# Altium schematic sheet MCU.SchDoc
size 292 x 193 mm; SheetNumber: 3; SheetTotal: 4
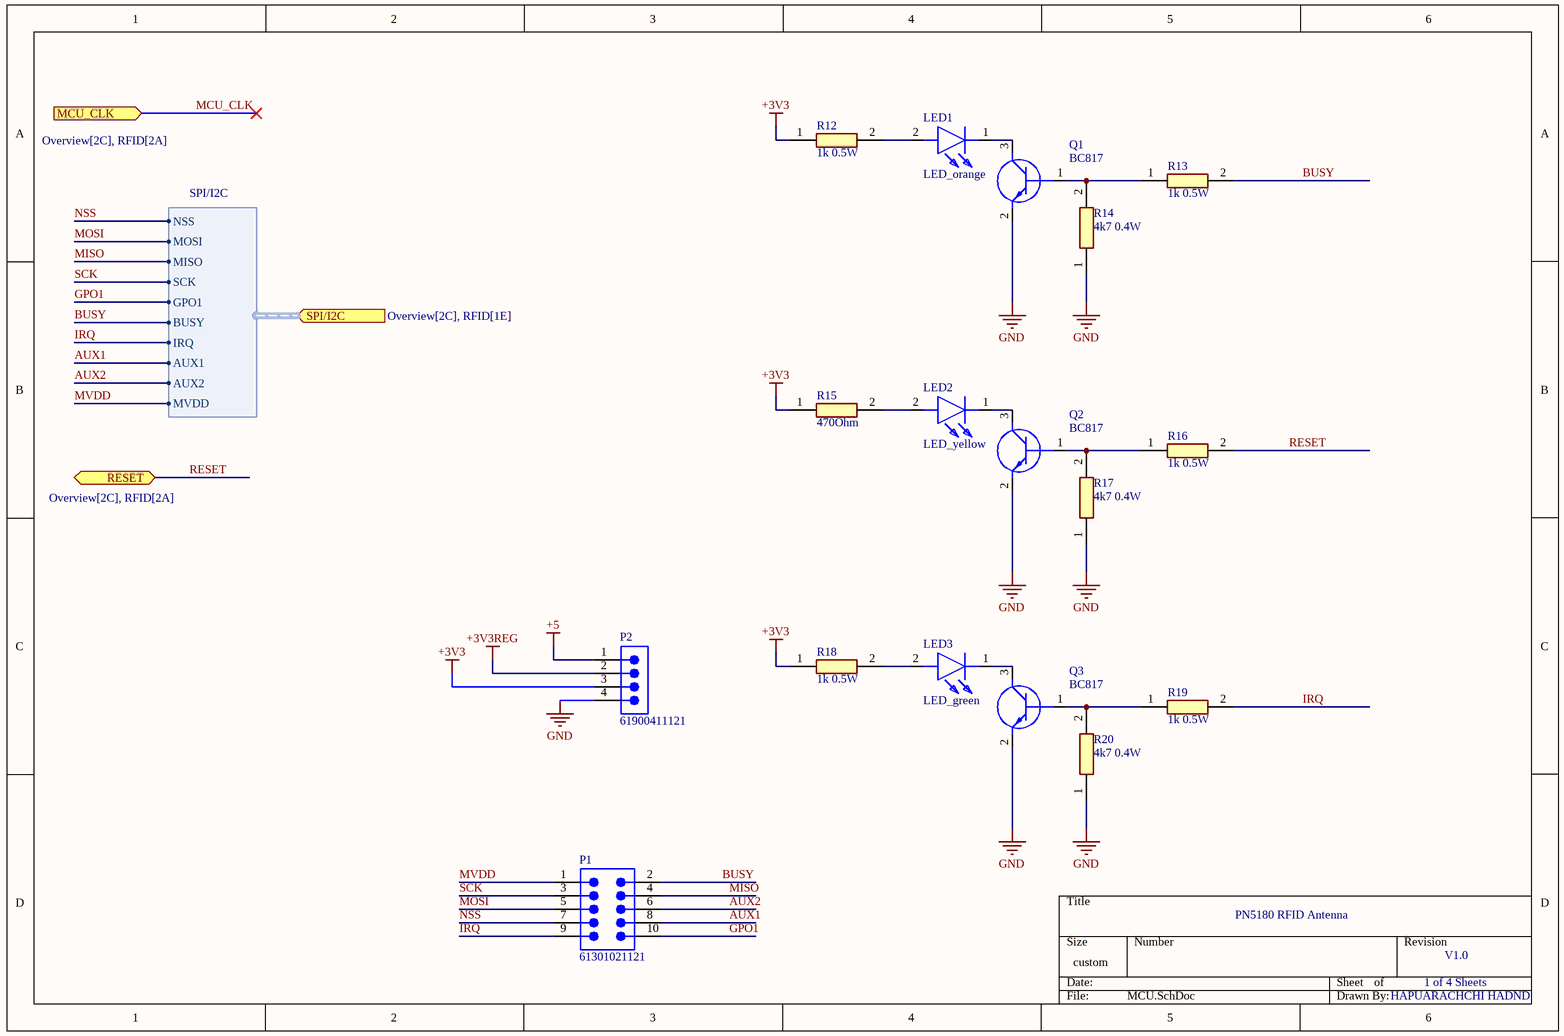
[diagram p0: MCU.SchDoc]

## Parts
LED1  LED_orange  [LEDC3216X120N]
LED2  LED_yellow  [LTSTC171KSKT]
LED3  LED_green  [LEDC2012X90N]
P1  61301021121  [61301021121]
P2  61900411121  [61900411121]
Q1  BC817  [SOT96P237X111-3N]
Q2  BC817  [SOT96P237X111-3N]
Q3  BC817  [SOT96P237X111-3N]
R12  1k 0.5W  [RESC1608X58N]
R13  1k 0.5W  [RESC1608X58N]
R14  4k7 0.4W  [RESC1608X55N_1]
R15  470Ohm  [RESC1608X55N]
R16  1k 0.5W  [RESC1608X58N]
R17  4k7 0.4W  [RESC1608X55N_1]
R18  1k 0.5W  [RESC1608X58N]
R19  1k 0.5W  [RESC1608X58N]
R20  4k7 0.4W  [RESC1608X55N_1]

## Ports
MCU_CLK (in, see Overview[2C], RFID[2A]), RESET (bidir, see Overview[2C], RFID[2A]), SPI/I2C (in, harness SPI/I2C, see Overview[2C], RFID[1E])

## Harnesses
SPI/I2C: NSS, MOSI, MISO, SCK, GPO1, BUSY, IRQ, AUX1, AUX2, MVDD

## Nets
+3V3: P2.3 R12.1 R15.1 R18.1
+3V3REG: P2.2
+5: P2.1
GND: P2.4 Q1.2(E) Q2.2(E) Q3.2(E) R14.1 R17.1 R20.1
AUX1: P1.8 ; port SPI/I2C.AUX1
AUX2: P1.6 ; port SPI/I2C.AUX2
BUSY: P1.2 R13.2 ; port SPI/I2C.BUSY
GPO1: P1.10 ; port SPI/I2C.GPO1
IRQ: P1.9 R19.2 ; port SPI/I2C.IRQ
MCU_CLK: port MCU_CLK
MISO: P1.4 ; port SPI/I2C.MISO
MOSI: P1.5 ; port SPI/I2C.MOSI
MVDD: P1.1 ; port SPI/I2C.MVDD
NSS: P1.7 ; port SPI/I2C.NSS
RESET: R16.2 ; port RESET
SCK: P1.3 ; port SPI/I2C.SCK
NetLED1_1: LED1.1(K) Q1.3(C)
NetLED1_2: LED1.2(A) R12.2
NetLED2_1: LED2.1(K) Q2.3(C)
NetLED2_2: LED2.2(A) R15.2
NetLED3_1: LED3.1(K) Q3.3(C)
NetLED3_2: LED3.2(A) R18.2
NetQ1_1: Q1.1(B) R13.1 R14.2
NetQ2_1: Q2.1(B) R16.1 R17.2
NetQ3_1: Q3.1(B) R19.1 R20.2

## Notes on the sheet
- PN5180 RFID Antenna
- 1 of 4 Sheets
- V1.0
- HAPUARACHCHI HADND

## Library data of the parts
LED1 = LED_orange: LED; Manufacturer_Name: Lite-On; Manufacturer_Part_Number: LTST-C150KAKT; Datasheet Link: http://media.digikey.com/pdf/Data%20Sheets/Lite-On%20PDFs/LTST-C150KAKT.pdf; Height: 1.2mm; Mouser Part Number: 859-LTST-C150KAKT; Mouser Price/Stock: https://www.mouser.co.uk/ProductDetail/Lite-On/LTST-C150KAKT?qs=Z3CaLxJiOJI8YYCkdyNq2A%3D%3D; Arrow Part Number: LTST-C150KAKT; Arrow Price/Stock: https://www.arrow.com/en/products/ltst-c150kakt/lite-on-technology?region=nac
LED2 = LED_yellow: LED; Manufacturer_Name: Lite-On; Manufacturer_Part_Number: LTST-C171KSKT; Datasheet Link: https://optoelectronics.liteon.com/upload/download/DS22-2000-110/LTST-C171KSKT.pdf; Height: 0.9mm; Mouser Part Number: 859-LTST-C171KSKT; Mouser Price/Stock: https://www.mouser.co.uk/ProductDetail/LITEON/LTST-C171KSKT?qs=llMtm9xcdM0CwR1bByTaUQ%3D%3D; Arrow Part Number: LTST-C171KSKT; Arrow Price/Stock: https://www.arrow.com/en/products/ltst-c171kskt/lite-on-technology?utm_currency=USD&region=nac
LED3 = LED_green: LED; Manufacturer_Name: Lite-On; Manufacturer_Part_Number: LTST-C171KGKT; Datasheet Link: https://optoelectronics.liteon.com/upload/download/DS22-2000-118/LTST-C171KGKT.pdf; Height: 0.9mm; Mouser Part Number: 859-LTST-C171KGKT; Mouser Price/Stock: https://www.mouser.co.uk/ProductDetail/LITEON/LTST-C171KGKT?qs=j1zysehuyChA38z%2F%252BFfUSw%3D%3D; Arrow Part Number: LTST-C171KGKT; Arrow Price/Stock: https://www.arrow.com/en/products/ltst-c171kgkt/lite-on-technology?region=nac
P1 = CMP-1502-01084-3: NexarPartId: 18818163; Connector Type: Male Pin; Insulation Resistance: 1GΩ; Row Spacing: 2.54mm; Insulation: Insulated; Number of Positions: 10; Current Rating: 3A; Voltage Rating: 250V; Gender: Male; Contact Resistance: 20mΩ; Contact Gender: Male; Number of Rows: 2; Min Operating Temperature: -40°C; Mount: Through Hole; Packaging: Bulk; Length: 12.7mm; Pitch: 2.54mm; RoHS: Compliant; Height: 2.54mm; Lead Pitch: 2.54mm; Number of Pins: 10; Housing Material: PBT; Orientation: Vertical; Flammability Rating: UL94 V-0; Termination: Through Hole; Width: 12.7mm; Color: Black; Contact Mating Length: 5.9944mm; Max Operating Temperature: 105°C; Operating Supply Voltage: 250V; Contact Material: Copper; Number of Contacts: 10; Contact Plating: Gold; REACH SVHC: Unknown
P2 = CMP-1502-00586-2: NexarPartId: 18818226; Connector Type: Male Pin; Insulation: Insulated; Number of Positions: 4; Gender: Male; Operating Supply Voltage: 250V; Pitch: 2.54mm; Current Rating: 3A; Insulation Resistance: 1GΩ; Contact Resistance: 20mΩ; Termination: Through Hole; Contact Material: Copper; Height: 3.3mm; Width: 10.2mm; RoHS: Compliant; REACH SVHC: Unknown; Max Operating Temperature: 105°C; Contact Plating: Tin; Lead Free: Lead Free; Contact Gender: Male; Lead Pitch: 2.54mm; Flammability Rating: UL94 V-0; Packaging: Bulk; Housing Material: Nylon; Number of Pins: 4; Number of Contacts: 4; Color: Beige; Number of Rows: 1; Orientation: Vertical; Contact Mating Length: 7.493mm; Mount: Through Hole; Min Operating Temperature: -40°C; Voltage Rating: 250V; Fastening Type: Friction; Length: 10.16mm
Q1-Q3 = BC817: Bipolar (BJT) Transistor NPN 80 V 500 mA 100MHz 225 mW Surface Mount SOT-23-3 (TO-236); Manufacturer_Name: onsemi; Manufacturer_Part_Number: SMMBTA06LT3G; Datasheet Link: https://www.onsemi.com/pub/Collateral/MMBTA05LT1-D.PDF; Height: 1.11mm; Mouser Part Number: 863-SMMBTA06LT3G; Mouser Price/Stock: https://www.mouser.co.uk/ProductDetail/onsemi/SMMBTA06LT3G?qs=uarJZ6H%252BeNrtzNKN%252B1EKYg%3D%3D
R12 R13 R16 R18 R19 = 1kOhm: 1 kOhms ±0.1% 0.5W, 1/2W Chip Resistor 0603 (1608 Metric) Thin Film; Manufacturer_Name: TE Connectivity; Manufacturer_Part_Number: RA73F1J1K0BTDF; Datasheet Link: https://www.te.com/commerce/DocumentDelivery/DDEController?Action=srchrtrv&DocNm=1773270-3&DocType=Data%20Sheet&DocLang=English&PartCntxt=2-2176474-6&DocFormat=pdf; Height: 0.58mm; Mouser Part Number: 279-RA73F1J1K0BTDF; Mouser Price/Stock: https://www.mouser.co.uk/ProductDetail/TE-Connectivity-Holsworthy/RA73F1J1K0BTDF?qs=Li%252BoUPsLEnve%2FJ8%252BWostNg%3D%3D
R14 R17 R20 = 4k7Ohm_0603: 4.7 kOhms ±1% 0.4W Chip Resistor 0603 (1608 Metric) Automotive AEC-Q200, Pulse Withstanding Thick Film; Manufacturer_Name: ROHM Semiconductor; Manufacturer_Part_Number: SDR03EZPF4701; Height: 0.55mm; Mouser Part Number: 755-SDR03EZPF4701; Mouser Price/Stock: https://www.mouser.co.uk/ProductDetail/ROHM-Semiconductor/SDR03EZPF4701?qs=byeeYqUIh0OpNXtQCyPv7A%3D%3D
R15 = 470Ohm: SMD 0603 470ohm 1% Anti Surge AEC-Q200; Manufacturer_Name: ROHM Semiconductor; Manufacturer_Part_Number: ESR03EZPF4700; Datasheet Link: https://componentsearchengine.com/Datasheets/2/ESR03EZPF4700.pdf; Height: 0.55mm; Mouser Part Number: 755-ESR03EZPF4700; Mouser Price/Stock: https://www.mouser.co.uk/ProductDetail/ROHM-Semiconductor/ESR03EZPF4700?qs=DyUWGjl%252BcVsZQGp8SgvEfA%3D%3D; Arrow Part Number: ESR03EZPF4700; Arrow Price/Stock: https://www.arrow.com/en/products/esr03ezpf4700/rohm-semiconductor?region=nac